# Altium schematic sheet FPGA_IO_CYUSB.SchDoc
size A4
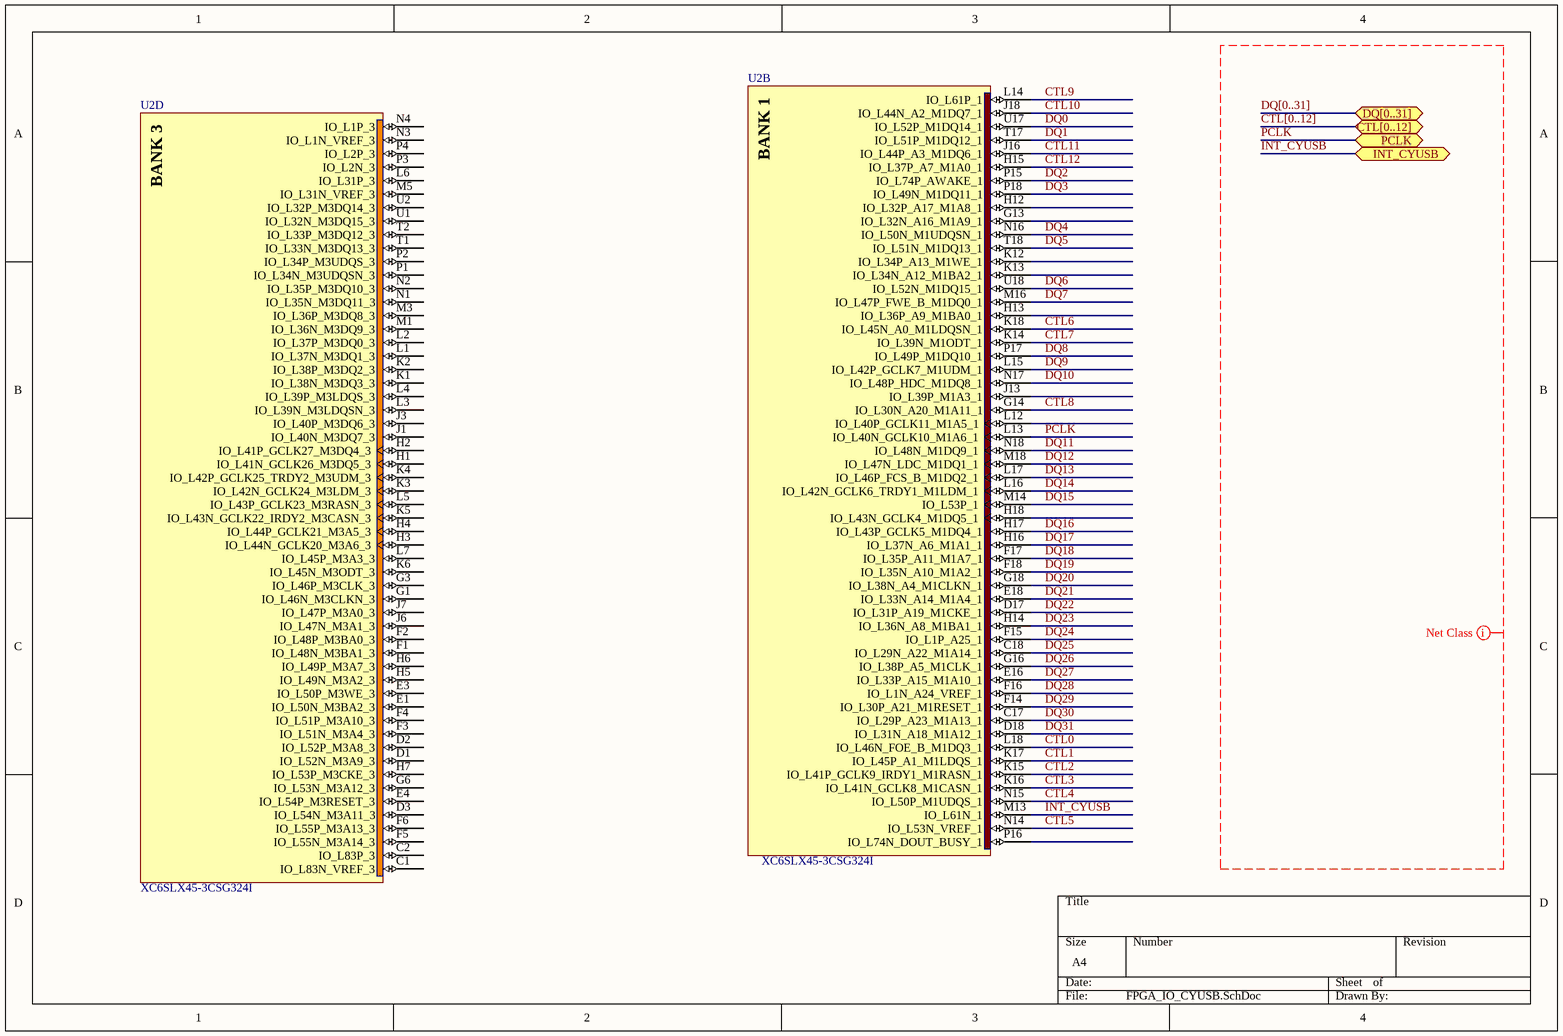
[diagram p0: FPGA_IO_CYUSB.SchDoc]

## Parts
U2  XC6SLX45-3CSG324I  [CSG324]  (parts B,D of 8)

## Ports
CTL[0..12], DQ[0..31], INT_CYUSB, PCLK

## Nets
CTL0: U2.L18(IO_L46N_FOE_B_M1DQ3_1)
CTL1: U2.K17(IO_L45P_A1_M1LDQS_1)
CTL2: U2.K15(IO_L41P_GCLK9_IRDY1_M1RASN_1)
CTL3: U2.K16(IO_L41N_GCLK8_M1CASN_1)
CTL4: U2.N15(IO_L50P_M1UDQS_1)
CTL5: U2.N14(IO_L53N_VREF_1)
CTL6: U2.K18(IO_L45N_A0_M1LDQSN_1)
CTL7: U2.K14(IO_L39N_M1ODT_1)
CTL8: U2.G14(IO_L30N_A20_M1A11_1)
CTL9: U2.L14(IO_L61P_1)
CTL10: U2.J18(IO_L44N_A2_M1DQ7_1)
CTL11: U2.J16(IO_L44P_A3_M1DQ6_1)
CTL12: U2.H15(IO_L37P_A7_M1A0_1)
DQ0: U2.U17(IO_L52P_M1DQ14_1)
DQ1: U2.T17(IO_L51P_M1DQ12_1)
DQ2: U2.P15(IO_L74P_AWAKE_1)
DQ3: U2.P18(IO_L49N_M1DQ11_1)
DQ4: U2.N16(IO_L50N_M1UDQSN_1)
DQ5: U2.T18(IO_L51N_M1DQ13_1)
DQ6: U2.U18(IO_L52N_M1DQ15_1)
DQ7: U2.M16(IO_L47P_FWE_B_M1DQ0_1)
DQ8: U2.P17(IO_L49P_M1DQ10_1)
DQ9: U2.L15(IO_L42P_GCLK7_M1UDM_1)
DQ10: U2.N17(IO_L48P_HDC_M1DQ8_1)
DQ11: U2.N18(IO_L48N_M1DQ9_1)
DQ12: U2.M18(IO_L47N_LDC_M1DQ1_1)
DQ13: U2.L17(IO_L46P_FCS_B_M1DQ2_1)
DQ14: U2.L16(IO_L42N_GCLK6_TRDY1_M1LDM_1)
DQ15: U2.M14(IO_L53P_1)
DQ16: U2.H17(IO_L43P_GCLK5_M1DQ4_1)
DQ17: U2.H16(IO_L37N_A6_M1A1_1)
DQ18: U2.F17(IO_L35P_A11_M1A7_1)
DQ19: U2.F18(IO_L35N_A10_M1A2_1)
DQ20: U2.G18(IO_L38N_A4_M1CLKN_1)
DQ21: U2.E18(IO_L33N_A14_M1A4_1)
DQ22: U2.D17(IO_L31P_A19_M1CKE_1)
DQ23: U2.H14(IO_L36N_A8_M1BA1_1)
DQ24: U2.F15(IO_L1P_A25_1)
DQ25: U2.C18(IO_L29N_A22_M1A14_1)
DQ26: U2.G16(IO_L38P_A5_M1CLK_1)
DQ27: U2.E16(IO_L33P_A15_M1A10_1)
DQ28: U2.F16(IO_L1N_A24_VREF_1)
DQ29: U2.F14(IO_L30P_A21_M1RESET_1)
DQ30: U2.C17(IO_L29P_A23_M1A13_1)
DQ31: U2.D18(IO_L31N_A18_M1A12_1)
INT_CYUSB: U2.M13(IO_L61N_1) ; port INT_CYUSB
PCLK: U2.L13(IO_L40N_GCLK10_M1A6_1) ; port PCLK

Not connected (* = marked no-connect by the designer): U2 C1(IO_L83N_VREF_3) C2(IO_L83P_3) D1(IO_L52N_M3A9_3) D2(IO_L52P_M3A8_3) D3(IO_L54N_M3A11_3) E1(IO_L50N_M3BA2_3) E3(IO_L50P_M3WE_3) E4(IO_L54P_M3RESET_3) F1(IO_L48N_M3BA1_3) F2(IO_L48P_M3BA0_3) F3(IO_L51N_M3A4_3) F4(IO_L51P_M3A10_3) F5(IO_L55N_M3A14_3) F6(IO_L55P_M3A13_3) G1(IO_L46N_M3CLKN_3) G3(IO_L46P_M3CLK_3) G6(IO_L53N_M3A12_3) G13(IO_L32N_A16_M1A9_1) H1(IO_L41N_GCLK26_M3DQ5_3) H2(IO_L41P_GCLK27_M3DQ4_3) H3(IO_L44N_GCLK20_M3A6_3) H4(IO_L44P_GCLK21_M3A5_3) H5(IO_L49N_M3A2_3) H6(IO_L49P_M3A7_3) H7(IO_L53P_M3CKE_3) H12(IO_L32P_A17_M1A8_1) H13(IO_L36P_A9_M1BA0_1) H18(IO_L43N_GCLK4_M1DQ5_1) J1(IO_L40N_M3DQ7_3) J3(IO_L40P_M3DQ6_3) J6(IO_L47N_M3A1_3) J7(IO_L47P_M3A0_3) J13(IO_L39P_M1A3_1) K1(IO_L38N_M3DQ3_3) K2(IO_L38P_M3DQ2_3) K3(IO_L42N_GCLK24_M3LDM_3) K4(IO_L42P_GCLK25_TRDY2_M3UDM_3) K5(IO_L43N_GCLK22_IRDY2_M3CASN_3) K6(IO_L45N_M3ODT_3) K12(IO_L34P_A13_M1WE_1) K13(IO_L34N_A12_M1BA2_1) L1(IO_L37N_M3DQ1_3) L2(IO_L37P_M3DQ0_3) L3(IO_L39N_M3LDQSN_3) L4(IO_L39P_M3LDQS_3) L5(IO_L43P_GCLK23_M3RASN_3) L6(IO_L31P_3) L7(IO_L45P_M3A3_3) L12(IO_L40P_GCLK11_M1A5_1) M1(IO_L36N_M3DQ9_3) M3(IO_L36P_M3DQ8_3) M5(IO_L31N_VREF_3) N1(IO_L35N_M3DQ11_3) N2(IO_L35P_M3DQ10_3) N3(IO_L1N_VREF_3) N4(IO_L1P_3) P1(IO_L34N_M3UDQSN_3) P2(IO_L34P_M3UDQS_3) P3(IO_L2N_3) P4(IO_L2P_3) P16(IO_L74N_DOUT_BUSY_1) T1(IO_L33N_M3DQ13_3) T2(IO_L33P_M3DQ12_3) U1(IO_L32N_M3DQ15_3) U2(IO_L32P_M3DQ14_3)

## Buses and harness runs
bus CTL[0..12] = port CTL[0..12]
bus DQ[0..31] = port DQ[0..31]

## Layout directives
net class CYUSB: CTL[0..12], DQ[0..31], INT_CYUSB, PCLK

## Notes on the sheet
- (in symbol XC6SLX45-3CSG324I, part B) BANK 1
- (in symbol XC6SLX45-3CSG324I, part D) BANK 3

## Library data of the parts
U2 = XC6SLX45-3CSG324I: Spartan-6 LX 1.2V FPGA, 218 User I/Os, 324-Ball Chip-Scale BGA (0.8mm Pitch), Speed Grade 3, Industrial Grade, Pb-Free; Published: 17-Nov-2009; DatasheetVersion: ver1.6, Nov-2010; PackageVersion: ver1.1, Nov-2009; PackageReference: CSG324; Publisher: Altium Limited; PackageDescription: 324-Ball Chip-Scale BGA (CSG324) Package, 0.8 mm Pitch; Supplier 1: Digi-Key; Supplier Part Number 1: XC6SLX45-3CSG324I-ND; Code_JEDEC: MO-275-KKAC-1; ComponentLink1Description: Manufacturer Link; ComponentLink1URL: http://www.xilinx.com; ComponentLink2Description: Spartan-6 Datasheet; ComponentLink2URL: http://www.xilinx.com/support/documentation/data_sheets/ds160.pdf; ComponentLink3Description: Spartan-6 Documents; ComponentLink3URL: http://www.xilinx.com/support/documentation/spartan-6.htm; ComponentLink4Description: Xilinx.com Home; ComponentLink4URL: http://www.xilinx.com